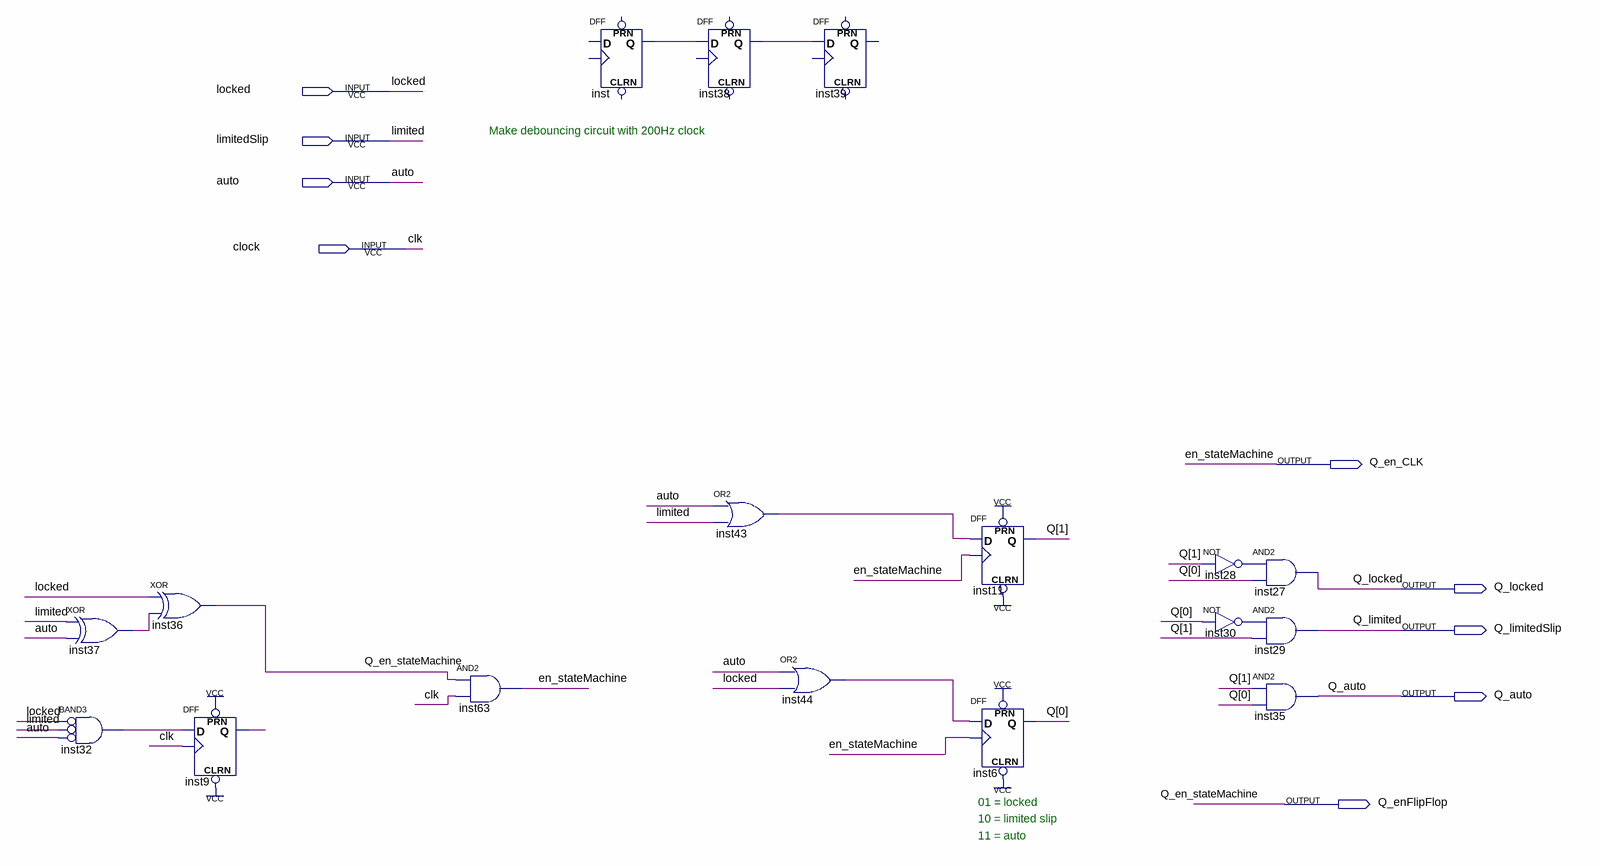
[diagram p0: schematic sheet]
// Quartus schematic differentialController_simulation.bdf as structural Verilog: 17 symbols, 9 pins
module differentialController_simulation (
  input  locked,
  input  limitedSlip,
  input  auto,
  input  clock,
  output Q_en_CLK,
  output Q_locked,
  output Q_limitedSlip,
  output Q_auto,
  output Q_enFlipFlop
);

  wire inst9_q, inst28_out, inst30_out, inst32_out, inst37_out, inst38_q, inst43_out, inst44_out, inst_q;
  wire [1:0] Q;

  and inst32 (inst32_out, ~locked, ~limitedSlip, ~auto);  // BAND3
  xor inst37 (inst37_out, limitedSlip, auto);
  xor inst36 (Q_enFlipFlop, locked, inst37_out);
  DFF inst9 (.CLRN(1'b1), .CLK(clock), .D(inst32_out), .PRN(1'b1), .Q(inst9_q));
  and inst63 (Q_en_CLK, Q_enFlipFlop, clock);
  DFF inst (.Q(inst_q));  // open: CLRN, CLK, D, PRN
  DFF inst38 (.D(inst_q), .Q(inst38_q));  // open: CLRN, CLK, PRN
  or inst43 (inst43_out, auto, limitedSlip);
  or inst44 (inst44_out, auto, locked);
  DFF inst39 (.D(inst38_q));  // open: CLRN, CLK, PRN, Q
  DFF inst11 (.CLRN(1'b1), .CLK(Q_en_CLK), .D(inst43_out), .PRN(1'b1), .Q(Q[1]));
  DFF inst6 (.CLRN(1'b1), .CLK(Q_en_CLK), .D(inst44_out), .PRN(1'b1), .Q(Q[0]));
  and inst27 (Q_locked, inst28_out, Q[0]);
  not inst28 (inst28_out, Q[1]);
  and inst29 (Q_limitedSlip, inst30_out, Q[1]);
  not inst30 (inst30_out, Q[0]);
  and inst35 (Q_auto, Q[1], Q[0]);

  // Other names for the same wires on the sheet: clk = clock; en_stateMachine = Q_en_CLK; limited = limitedSlip;
  //   Q_en_stateMachine = Q_enFlipFlop; Q_limited = Q_limitedSlip

  // Notes on the sheet:
  //   Make debouncing circuit with 200Hz clock
  //   01 = locked
  //   10 = limited slip
  //   11 = auto
endmodule
